# EAGLE design nes-cartridge (EAGLE 9.6.2)
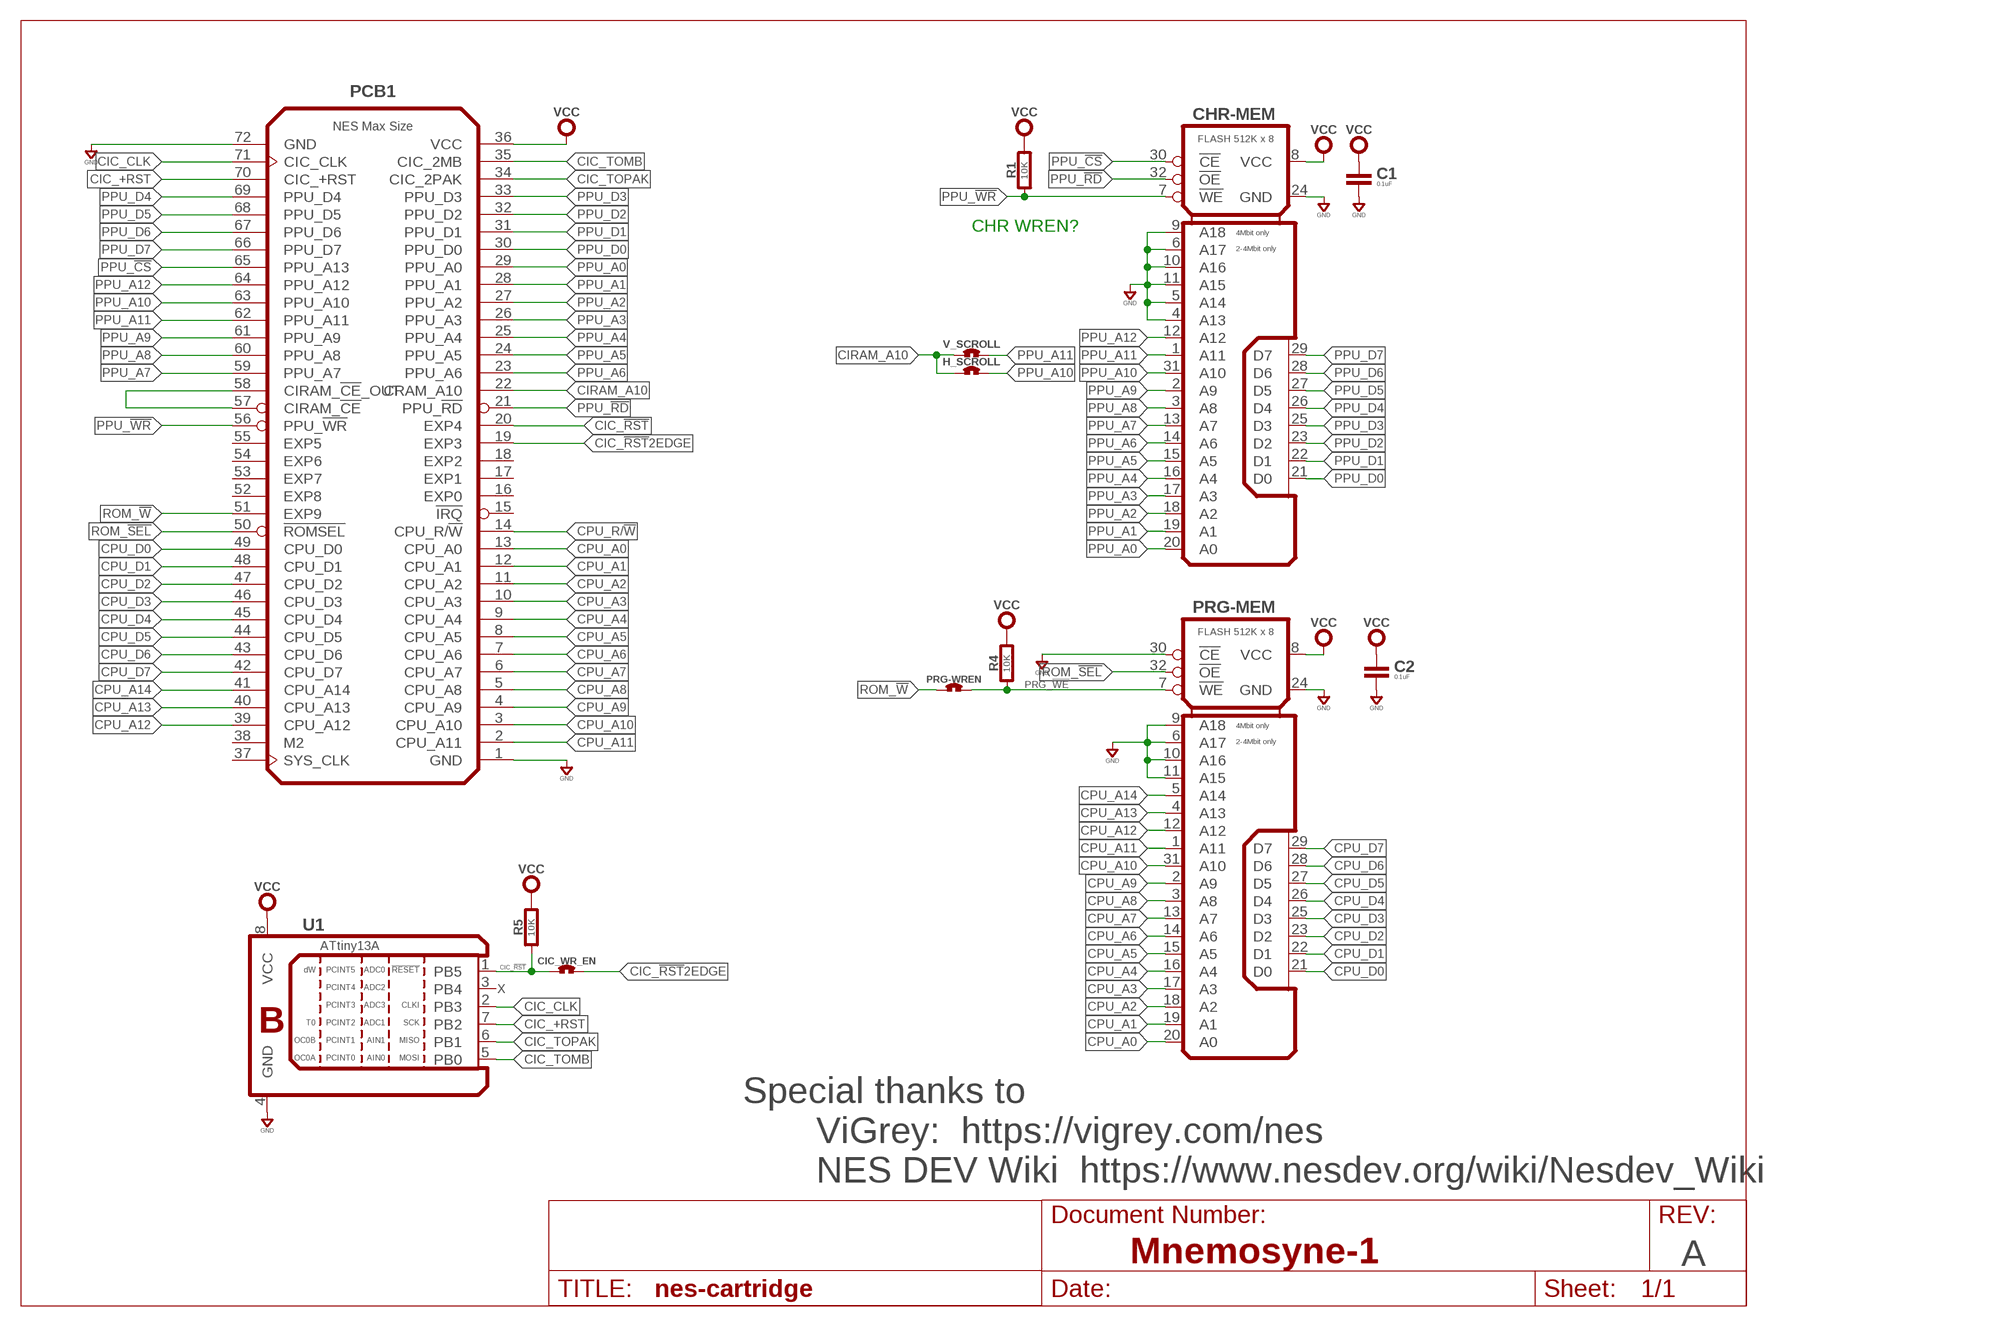
[diagram p0: schematic, sheet 1]
FRAME1 (LETTER_L): DOCUMENT_NUMBER: Mnemosyne-1; REV: A

## Parts
C1  0.1uF  CAPACITOR0603  [0603-CAP]
C2  0.1uF  CAPACITOR0603  [0603-CAP]
CHR-MEM  FLASH 512K x 8  FLASH_512KX8-512K-TSOP  [TSOP32-14X8MM]
CIC_WR_EN  SOLDER_JUMPER-80MIL-RND  [SOLDER_JUMP_80MIL_RND]
H_SCROLL  SOLDER_JUMPER-80MIL-RND  [SOLDER_JUMP_80MIL_RND]
PCB1  NES Max Size  NES-CARTRIDGE-MAX  [NES-1-MIN]
PRG-MEM  FLASH 512K x 8  FLASH_512KX8-512K-TSOP  [TSOP32-14X8MM]
PRG-WREN  SOLDER_JUMPER-80MIL-RND  [SOLDER_JUMP_80MIL_RND]
R1  10K  RESISTOR0603  [0603-RES]
R4  10K  RESISTOR0603  [0603-RES]
R5  10K  RESISTOR0603  [0603-RES]
U1  ATtiny13A  ATTINY13A-SO8  [SOIC-8S2]
V_SCROLL  SOLDER_JUMPER-80MIL-RND  [SOLDER_JUMP_80MIL_RND]

## Nets
CIC_!RST: CIC_WR_EN.1 PCB1.20(EXP4) R5.1 U1.1(PB5)
CIC_!RST!2EDGE: CIC_WR_EN.2 PCB1.19(EXP3)
CIC_+RST: PCB1.70(CIC_+RST) U1.7(PB2)
CIC_CLK: PCB1.71(CIC_CLK) U1.2(PB3)
CIC_TOMB: PCB1.35(CIC_2MB) U1.5(PB0)
CIC_TOPAK: PCB1.34(CIC_2PAK) U1.6(PB1)
CIRAM_A10: H_SCROLL.1 PCB1.22(CRAM_A10) V_SCROLL.1
CPU_A0: PCB1.13(CPU_A0) PRG-MEM.20(A0)
CPU_A1: PCB1.12(CPU_A1) PRG-MEM.19(A1)
CPU_A2: PCB1.11(CPU_A2) PRG-MEM.18(A2)
CPU_A3: PCB1.10(CPU_A3) PRG-MEM.17(A3)
CPU_A4: PCB1.9(CPU_A4) PRG-MEM.16(A4)
CPU_A5: PCB1.8(CPU_A5) PRG-MEM.15(A5)
CPU_A6: PCB1.7(CPU_A6) PRG-MEM.14(A6)
CPU_A7: PCB1.6(CPU_A7) PRG-MEM.13(A7)
CPU_A8: PCB1.5(CPU_A8) PRG-MEM.3(A8)
CPU_A9: PCB1.4(CPU_A9) PRG-MEM.2(A9)
CPU_A10: PCB1.3(CPU_A10) PRG-MEM.31(A10)
CPU_A11: PCB1.2(CPU_A11) PRG-MEM.1(A11)
CPU_A12: PCB1.39(CPU_A12) PRG-MEM.12(A12)
CPU_A13: PCB1.40(CPU_A13) PRG-MEM.4(A13)
CPU_A14: PCB1.41(CPU_A14) PRG-MEM.5(A14)
CPU_D0: PCB1.49(CPU_D0) PRG-MEM.21(D0)
CPU_D1: PCB1.48(CPU_D1) PRG-MEM.22(D1)
CPU_D2: PCB1.47(CPU_D2) PRG-MEM.23(D2)
CPU_D3: PCB1.46(CPU_D3) PRG-MEM.25(D3)
CPU_D4: PCB1.45(CPU_D4) PRG-MEM.26(D4)
CPU_D5: PCB1.44(CPU_D5) PRG-MEM.27(D5)
CPU_D6: PCB1.43(CPU_D6) PRG-MEM.28(D6)
CPU_D7: PCB1.42(CPU_D7) PRG-MEM.29(D7)
CPU_R/!W: PCB1.14(CPU_R/!W)
GND: C1.2 C2.2 CHR-MEM.4(A13) CHR-MEM.5(A14) CHR-MEM.6(A17) CHR-MEM.9(A18) CHR-MEM.10(A16) CHR-MEM.11(A15) CHR-MEM.24(GND) PCB1.1(GND) PCB1.72(GND) PRG-MEM.6(A17) PRG-MEM.9(A18) PRG-MEM.10(A16) PRG-MEM.11(A15) PRG-MEM.24(GND) U1.4(GND)
N$1: PRG-MEM.30(!CE) ; supply symbol labelled GND
N$29: PCB1.57(CIRAM_!CE) PCB1.58(CIRAM_!CE!_OUT)
PPU_!CS: CHR-MEM.30(!CE) PCB1.65(PPU_A13)
PPU_!RD: CHR-MEM.32(!OE) PCB1.21(PPU_!RD)
PPU_!WR: CHR-MEM.7(!WE) PCB1.56(PPU_!WR) R1.1
PPU_A0: CHR-MEM.20(A0) PCB1.29(PPU_A0)
PPU_A1: CHR-MEM.19(A1) PCB1.28(PPU_A1)
PPU_A2: CHR-MEM.18(A2) PCB1.27(PPU_A2)
PPU_A3: CHR-MEM.17(A3) PCB1.26(PPU_A3)
PPU_A4: CHR-MEM.16(A4) PCB1.25(PPU_A4)
PPU_A5: CHR-MEM.15(A5) PCB1.24(PPU_A5)
PPU_A6: CHR-MEM.14(A6) PCB1.23(PPU_A6)
PPU_A7: CHR-MEM.13(A7) PCB1.59(PPU_A7)
PPU_A8: CHR-MEM.3(A8) PCB1.60(PPU_A8)
PPU_A9: CHR-MEM.2(A9) PCB1.61(PPU_A9)
PPU_A10: CHR-MEM.31(A10) H_SCROLL.2 PCB1.63(PPU_A10)
PPU_A11: CHR-MEM.1(A11) PCB1.62(PPU_A11) V_SCROLL.2
PPU_A12: CHR-MEM.12(A12) PCB1.64(PPU_A12)
PPU_D0: CHR-MEM.21(D0) PCB1.30(PPU_D0)
PPU_D1: CHR-MEM.22(D1) PCB1.31(PPU_D1)
PPU_D2: CHR-MEM.23(D2) PCB1.32(PPU_D2)
PPU_D3: CHR-MEM.25(D3) PCB1.33(PPU_D3)
PPU_D4: CHR-MEM.26(D4) PCB1.69(PPU_D4)
PPU_D5: CHR-MEM.27(D5) PCB1.68(PPU_D5)
PPU_D6: CHR-MEM.28(D6) PCB1.67(PPU_D6)
PPU_D7: CHR-MEM.29(D7) PCB1.66(PPU_D7)
PRG_!WE: PRG-MEM.7(!WE) PRG-WREN.2 R4.1
ROM_!SEL: PCB1.50(!ROMSEL) PRG-MEM.32(!OE)
ROM_!W: PCB1.51(EXP9) PRG-WREN.1
VCC: C1.1 C2.1 CHR-MEM.8(VCC) PCB1.36(VCC) PRG-MEM.8(VCC) R1.2 R4.2 R5.2 U1.8(VCC)
Unconnected: PCB1.15(!IRQ) PCB1.16(EXP0) PCB1.17(EXP1) PCB1.18(EXP2) PCB1.37(SYS_CLK) PCB1.38(M2) PCB1.52(EXP8) PCB1.53(EXP7) PCB1.54(EXP6) PCB1.55(EXP5) U1.3(PB4)

## Notes on the sheet
- CHR WREN?
- X
- Special thanks to 
         ViGrey:  https://vigrey.com/nes
         NES DEV Wiki  https://www.nesdev.org/wiki/Nesdev_Wiki

## Library data of the parts
C1 C2 = rlc:CAPACITOR: Capacitor; COST01: 0.12; COST10: 0.09; COST100: 0.05
CHR-MEM PRG-MEM = logic:FLASH_512KX8: Flash - 8 bit parallel, up to 512Kx8; COST01: 2.30; COST10: 2.10; COST100: 1.80; MFR: Microchip; MPN: SST39SF040-70-4C-Wxx
CIC_WR_EN H_SCROLL PRG-WREN V_SCROLL = rlc:SOLDER_JUMPER
PCB1 = game-cartridge:NES-CARTRIDGE: NES Cartridge
R1 R4 R5 = rlc:RESISTOR: Resistor; COST01: 0.10; COST10: 0.05; COST100: 0.02
U1 = atmel-atmega:ATTINY13A: ATmega 13A microcontroller; COST01: 1.10; COST10: 1.00; COST100: 0.80; MFR: Microchip; MPN: ATTINY13A-S

## Board
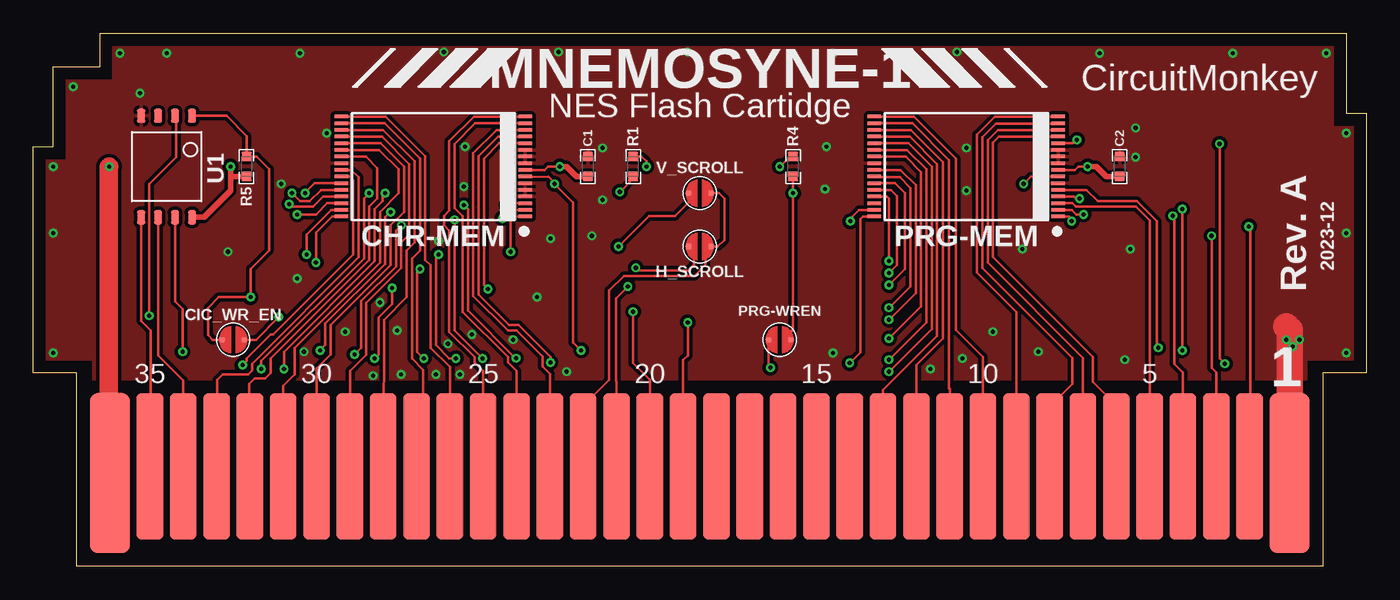
[diagram p1: board, top side]
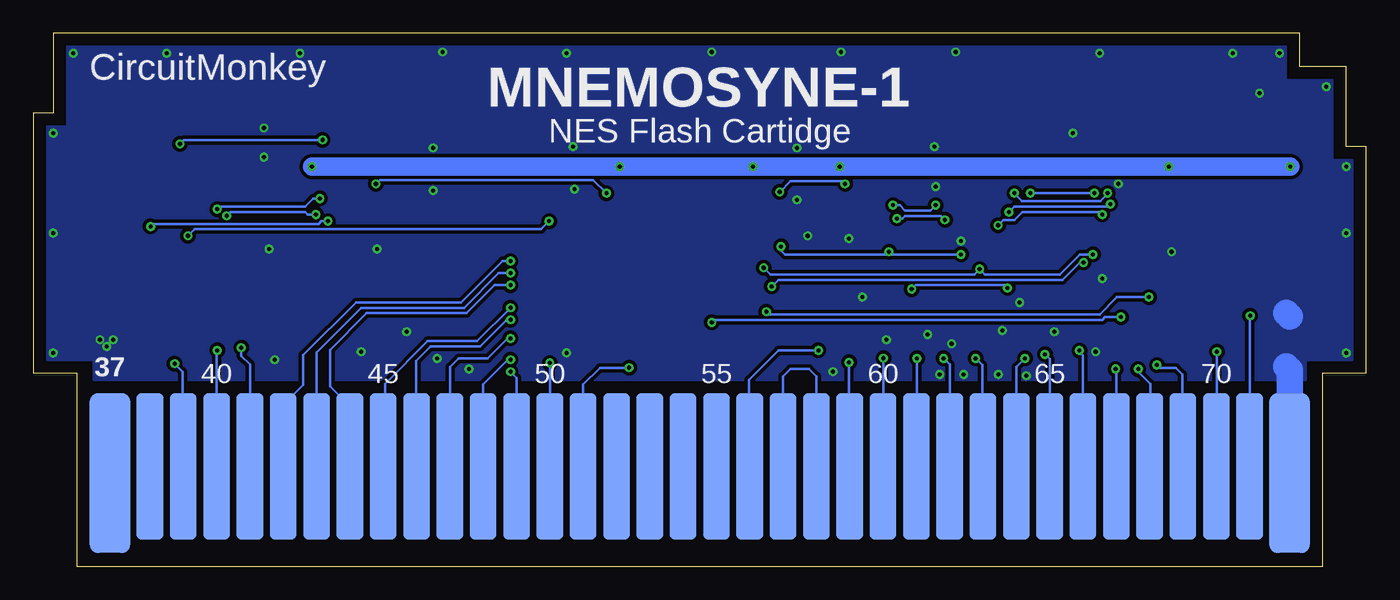
[diagram p2: board, bottom side, seen from below]

Size 100 x 40 mm. Coordinates in mm from the lower left corner, seen from the top.
Copper layers (1*16): Top 0.0356mm / dielectric 1.5011mm / Bottom 0.0356mm
Design rules "OSH-CircuitMonkey": minimum track width 6mil, minimum drill 12mil, track to track 6mil, track to pad 6mil, pad to pad 6mil, via to via 6mil, smd to smd 6mil, copper to edge 15mil, drill to drill 6mil, minimum pad ring 7mil, minimum via ring 7mil, stop-mask expansion 3mil, vias tented up to drill 13mil, thermal gap 10mil

### Footprints (pad centres in the part's own frame; a part is rotated, then mirrored left to right if it is on the bottom)
0603-CAP = smd 0.711 x 0.762: 1 -0.752,0; 2 0.752,0
TSOP32-14X8MM = smd 0.27 x 1.1: 1 -3.75,-6.9; 2 -3.25,-6.9; 3 -2.75,-6.9; 4 -2.25,-6.9; 5 -1.75,-6.9; 6 -1.25,-6.9; 7 -0.75,-6.9; 8 -0.25,-6.9; 9 0.25,-6.9; 10 0.75,-6.9; 11 1.25,-6.9; 12 1.75,-6.9; 13 2.25,-6.9; 14 2.75,-6.9; 15 3.25,-6.9; 16 3.75,-6.9; 17 3.75,6.9; 18 3.25,6.9; 19 2.75,6.9; 20 2.25,6.9; 21 1.75,6.9; 22 1.25,6.9; 23 0.75,6.9; 24 0.25,6.9; 25 -0.25,6.9; 26 -0.75,6.9; 27 -1.25,6.9; 28 -1.75,6.9; 29 -2.25,6.9; 30 -2.75,6.9; 31 -3.25,6.9; 32 -3.75,6.9
SOLDER_JUMP_80MIL_RND = smd 0.406 x 0.406: 1 -0.838,0; 2 0.838,0
NES-1-MIN = smd 3 x 12: 1 94.25,7; 36 5.75,7 | smd 2 x 11: 2 91.25,7.5; 3 88.75,7.5; 4 86.25,7.5; 5 83.75,7.5; 6 81.25,7.5; 7 78.75,7.5; 8 76.25,7.5; 9 73.75,7.5; 10 71.25,7.5; 11 68.75,7.5; 12 66.25,7.5; 13 63.75,7.5; 14 61.25,7.5; 15 58.75,7.5; 16 56.25,7.5; 17 53.75,7.5; 18 51.25,7.5; 19 48.75,7.5; 20 46.25,7.5; 21 43.75,7.5; 22 41.25,7.5; 23 38.75,7.5; 24 36.25,7.5; 25 33.75,7.5; 26 31.25,7.5; 27 28.75,7.5; 28 26.25,7.5; 29 23.75,7.5; 30 21.25,7.5; 31 18.75,7.5; 32 16.25,7.5; 33 13.75,7.5; 34 11.25,7.5; 35 8.75,7.5 | smd 3 x 12 bottom: 37 94.25,7; 72 5.75,7 | smd 2 x 11 bottom: 38 91.25,7.5; 39 88.75,7.5; 40 86.25,7.5; 41 83.75,7.5; 42 81.25,7.5; 43 78.75,7.5; 44 76.25,7.5; 45 73.75,7.5; 46 71.25,7.5; 47 68.75,7.5; 48 66.25,7.5; 49 63.75,7.5; 50 61.25,7.5; 51 58.75,7.5; 52 56.25,7.5; 53 53.75,7.5; 54 51.25,7.5; 55 48.75,7.5; 56 46.25,7.5; 57 43.75,7.5; 58 41.25,7.5; 59 38.75,7.5; 60 36.25,7.5; 61 33.75,7.5; 62 31.25,7.5; 63 28.75,7.5; 64 26.25,7.5; 65 23.75,7.5; 66 21.25,7.5; 67 18.75,7.5; 68 16.25,7.5; 69 13.75,7.5; 70 11.25,7.5; 71 8.75,7.5
0603-RES = smd 0.711 x 0.762: 1 -0.752,0; 2 0.752,0
SOIC-8S2 = smd 0.61 x 1.067: 1 -1.905,-3.81; 2 -0.635,-3.81; 3 0.635,-3.81; 4 1.905,-3.81; 5 1.905,3.81; 6 0.635,3.81; 7 -0.635,3.81; 8 -1.905,3.81

### Placement (x,y rotation side)
C1  41.6,30 90 top
C2  81.5,30 90 top
CHR-MEM  30,30 90 top
CIC_WR_EN  15,17 0 top
H_SCROLL  50,24 180 top
PCB1  0,0 0 top
PRG-MEM  70,30 90 top
PRG-WREN  56,17 0 top
R1  45,30 90 top
R4  57,30 90 top
R5  16,30 270 top
U1  10,30 180 top
V_SCROLL  50,28 180 top

### Tracks (layer width: path | path; a pad name or v marks a point on that pad's centre or on a via)
CIC_!RST  (via drill 0.3)
  Top 0.2: CIC_WR_EN.1 13.46,17 13.1,17.36 13.1,19.4 13.9,20.2 v16.3,20.2 16.3,22.3 17.7,23.7 17.7,29.8 16.75,30.75 R5.1 16,32.3 14.49,33.81 U1.1 | v45,19.1 45,15.25 46.25,14 PCB1.20
  Bottom 0.2: v16.3,20.2 18.7,20.2 20,18.9 44.8,18.9 v45,19.1
CIC_!RST!2EDGE  (via drill 0.3)
  Top 0.2: CIC_WR_EN.2 16.7,17 v18.4,18.7 | v49.1,18.3 49.1,15.82 48.75,15.47 PCB1.19
  Bottom 0.2: v18.4,18.7 19.6,18.7 19.8,18.5 48.9,18.5 v49.1,18.3
CIC_+RST  (via drill 0.3)
  Top 0.2: U1.7 10.63,19.86 11.2,19.3 v11.2,16.1
  Bottom 0.2: v11.2,16.1 11.2,7.55 PCB1.70
CIC_CLK  (via drill 0.3)
  Top 0.2: U1.2 10.7,33.74 10.7,30.7 8.7,28.7 v8.7,18.8
  Bottom 0.2: PCB1.71 8.75,18.75 v8.7,18.8
CIC_TOMB
  Top 0.2: U1.5 8.1,18.41 8.8,17.7 8.8,7.55 PCB1.35
CIC_TOPAK
  Top 0.2: U1.6 9.37,15.84 11.25,13.95 PCB1.34
CIRAM_A10
  Top 0.2: PCB1.22 41.25,12.05 43.2,14 43.2,20.7 44.3,21.8 49.6,21.8 50.44,22.64 50.44,23.6 H_SCROLL.1 51.34,24 51.84,24.5 51.84,27.6 51.44,28 V_SCROLL.1
CPU_A0
  Top 0.2: PRG-MEM.20 65.75,32.25 67.8,30.2 67.8,17.3 63.75,13.25 PCB1.13
CPU_A1
  Top 0.2: PRG-MEM.19 65.85,32.75 68.25,30.35 68.25,17.1 66.25,15.1 PCB1.12
CPU_A2
  Top 0.2: PCB1.11 68.75,13.3 68.7,13.35 68.7,30.5 65.95,33.25 PRG-MEM.18
CPU_A3
  Top 0.2: PCB1.10 71.25,15.7 69.2,17.75 69.2,30.6 66.05,33.75 PRG-MEM.17
CPU_A4
  Top 0.2: PCB1.9 73.75,19.1 70.8,22.05 70.8,32.4 72.15,33.75 PRG-MEM.16
CPU_A5
  Top 0.2: PRG-MEM.15 76.85,33.2 72.2,33.2 71.2,32.2 71.2,22.4 77.95,15.65 77.95,13.7 76.25,12 PCB1.8
CPU_A6
  Top 0.2: PRG-MEM.14 72.35,32.75 71.6,32 71.6,22.8 78.75,15.65 PCB1.7
CPU_A7
  Top 0.2: PCB1.6 81.25,12.1 79.5,13.85 79.5,15.7 72,23.2 72,31.8 72.45,32.25 PRG-MEM.13
CPU_A8
  Top 0.2: PCB1.5 83.75,25.95 82.7,27 78.2,27 77.95,27.25 PRG-MEM.3
CPU_A9  (via drill 0.3)
  Top 0.2: PCB1.4 86.25,14.55 85.6,15.2 85.6,26.2 v85.5,26.3 | PRG-MEM.2 77.9,26.75 78.25,26.4 v78.8,26.4
  Bottom 0.2: v85.5,26.3 85.2,26.6 79.6,26.6 79.4,26.4 v78.8,26.4
CPU_A10  (via drill 0.3)
  Top 0.2: PCB1.3 88.75,14.53 88.4,14.88 v88.4,24.8 | PRG-MEM.31 61.95,26.75 61.3,26.1 v61.3,25.9
  Bottom 0.2: v61.3,25.9 61.9,25.3 87.9,25.3 v88.4,24.8
CPU_A11  (via drill 0.3)
  Top 0.2: PCB1.2 91.3,7.55 91.3,25.4 v91.2,25.5 | v77.9,25.9 77.9,26.05 77.7,26.25 PRG-MEM.1
  Bottom 0.2: v77.9,25.9 78.4,25.9 78.6,25.7 91,25.7 v91.2,25.5
CPU_A12  (via drill 0.3)
  Top 0.2: v89,31.7 89,15.6 v89.4,15.2 | PRG-MEM.12 78,31.75 78.25,32 v78.3,32
  Bottom 0.2: PCB1.39 88.8,7.55 88.8,14.6 v89.4,15.2 | v89,31.7 88.7,32 v78.3,32
CPU_A13  (via drill 0.3)
  Top 0.2: PRG-MEM.4 78.05,27.75 78.2,27.6 v78.5,27.6 | v86.2,26.8 v86.2,16.2
  Bottom 0.2: v78.5,27.6 79,27.6 79.6,27 86,27 v86.2,26.8 | v86.2,16.2 86.25,16.15 PCB1.40
CPU_A14  (via drill 0.3)
  Top 0.2: PRG-MEM.5 79.02,28.25 79.87,27.4 82.8,27.4 84.3,25.9 84.3,16.7 84.4,16.6 v84.4,16.4
  Bottom 0.2: PCB1.41 83.75,15.15 84.4,15.8 v84.4,16.4
CPU_D0  (via drill 0.3)
  Top 0.2: PRG-MEM.21 65.65,31.75 67.4,30 67.4,17.8 v64.2,14.6
  Bottom 0.2: v64.2,14.6 63.75,14.15 PCB1.49
CPU_D1  (via drill 0.3)
  Top 0.2: PRG-MEM.22 65.55,31.25 67,29.8 67,18.3 v64.2,15.5
  Bottom 0.2: PCB1.48 66.25,13.65 64.4,15.5 v64.2,15.5
CPU_D2  (via drill 0.3)
  Top 0.2: PRG-MEM.23 65.45,30.75 66.6,29.6 66.6,19.5 v64.2,17.1
  Bottom 0.2: v64.2,17.1 64.4,17.1 65.9,15.6 68.1,15.6 68.75,14.95 PCB1.47
CPU_D3  (via drill 0.3)
  Top 0.2: PRG-MEM.25 65.05,29.75 66.2,28.6 66.2,20.5 v64.2,18.5
  Bottom 0.2: PCB1.46 71.3,7.55 71.3,15.4 70.2,16.5 66.5,16.5 64.5,18.5 v64.2,18.5
CPU_D4  (via drill 0.3)
  Top 0.2: PRG-MEM.26 63.15,29.2 65,29.2 65.8,28.4 65.8,21 v64.2,19.4
  Bottom 0.2: PCB1.45 73.6,7.65 73.6,13.7 70.4,16.9 66.7,16.9 v64.2,19.4
CPU_D5  (via drill 0.3)
  Top 0.2: PRG-MEM.27 64.65,28.75 65.4,28 65.4,22.3 v64.2,21.1
  Bottom 0.2: v64.2,21.1 65.4,21.1 67.5,19 75,19 77.75,16.25 77.75,13.5 76.25,12 PCB1.44
CPU_D6  (via drill 0.3)
  Top 0.2: PRG-MEM.28 64.35,28.25 64.8,27.8 64.8,22.6 v64.2,22
  Bottom 0.2: PCB1.43 78.75,16.05 75.4,19.4 67.7,19.4 65.1,22 v64.2,22
CPU_D7  (via drill 0.3)
  Top 0.2: PRG-MEM.29 64.05,27.75 64.2,27.6 v64.2,22.9
  Bottom 0.2: PCB1.42 81.25,12.1 79.75,13.6 79.75,15.85 75.8,19.8 67.9,19.8 64.8,22.9 v64.2,22.9
GND  (via drill 0.3)
  Top 1.27: 94.25,16.75 v94,17
  Top 2: 94.25,16.75 PCB1.1 94.25,17.75 94,18
  Bottom 2: 5.75,18.75 6,19 | PCB1.72 5.75,14.75 6,15
  other vias: 1.5,16 1.5,30 3,36 6.5,38.5 97,38.5 98.5,32.5 98.5,16 95,17 94.5,16.5 8,35.5 22,32.5 42.7,27.5 49.1,38.6 60,38.5 39.4,38.6 69.3,38.6 80,38.5 90,38.5 30.8,38.6 20,38.5 10,38.5 1.5,25 98.5,25 60,16 40,14.6 30.2,14.4 74.2,23.8 82.3,23.8 81.9,15.5 30.4,24.4 32.3,28.5 32.4,31.5 42.7,31.4 82.7,30.7 82.7,32.9 70,31.4 70,28.2 59.5,31.5 59.4,28.3 18.6,28.7 20.3,16.1 23.4,17.6 27.3,17.7 32.9,17.4 31.1,16.7 36,17 32,14.4 27.6,14.4 25.5,14.3 26,19.8 67.3,14.8 75.4,16.1 72,17.6 69.7,15.6 37.8,20.2 19.8,21.6 41.9,24.8 38.8,24.6 14.6,23.6
  pour Top (isolate 0.254, rank 5): 4.5,15.5 1,15.5 1,30.5 2.5,30.5 2.5,36.5 6,36.5 6,39 97.5,39 97.5,33 99,33 99,15.5 95.5,15.5 95.5,14 4.5,14
  pour Bottom (isolate 0.254, rank 5): 4.5,15.5 1,15.5 1,30.5 2.5,30.5 2.5,36.5 6,36.5 6,39 97.5,39 97.5,33 99,33 99,15.5 95.5,15.5 95.5,14 4.5,14
N$29
  Bottom 0.2: PCB1.58 41.25,14.25 41.8,14.8 43.2,14.8 43.75,14.25 PCB1.57
PPU_!CS  (via drill 0.3)
  Top 0.2: CHR-MEM.30 22.05,27.25 21.2,26.4 v19.8,26.4 | v27.61,25.59 27.22,25.2 27.2,25.2 27.2,22.5 24.6,19.9 24.6,16.4 v24.1,15.9
  Bottom 0.2: PCB1.65 23.75,15.55 v24.1,15.9 | v19.8,26.4 20,26.6 25.8,26.6 26.41,25.99 27.21,25.99 v27.61,25.59
PPU_!RD  (via drill 0.3)
  Top 0.2: PCB1.21 43.75,13.85 43.7,13.9 43.7,20.1 v44.6,21 | CHR-MEM.32 22.4,26.25 21.2,25.05 v21.2,22.8
  Bottom 0.2: v21.2,22.8 21.5,22.8 22.8,21.5 44.1,21.5 v44.6,21
PPU_!WR  (via drill 0.3)
  Top 0.152: CHR-MEM.7 38.65,29.25 39.15,28.75 v39.1,28.7
  Top 0.2: v39.1,28.7 40.5,27.3 40.5,16.8 v41.1,16.2 | R1.1 45,29.1 v44,28.1
  Bottom 0.2: v41.1,16.2 44.1,16.2 46.3,14 46.3,7.55 PCB1.56 | v39.1,28.7 39.3,28.9 43.2,28.9 v44,28.1
PPU_A0
  Top 0.2: PCB1.29 23.75,14.65 24.95,15.85 24.95,19.75 27.6,22.4 27.6,24.3 28.2,24.9 28.2,30.2 26.15,32.25 CHR-MEM.20
PPU_A1
  Top 0.2: CHR-MEM.19 26.25,32.75 28.6,30.4 28.6,24.3 28,23.7 28,20.2 26.3,18.5 26.3,15.9 PCB1.28
PPU_A2
  Top 0.2: CHR-MEM.18 26.35,33.25 29,30.6 29,23.7 28.4,23.1 28.4,15.6 29.25,14.75 29.25,8 PCB1.27
PPU_A3
  Top 0.2: CHR-MEM.17 26.45,33.75 29.4,30.8 29.4,23 29.8,22.6 29.8,16.39 31.25,14.95 PCB1.26
PPU_A4
  Top 0.2: PCB1.25 33.75,14.65 33.1,15.3 33.1,15.7 31.2,17.6 31.2,25.2 30.8,25.6 30.8,26.3 31.2,26.7 31.2,31.9 33.05,33.75 CHR-MEM.16
PPU_A5
  Top 0.2: PCB1.24 36.25,14.65 35.6,15.3 35.6,15.7 32.2,19.1 32.2,26.3 31.6,26.9 31.6,31.7 33.15,33.25 CHR-MEM.15
PPU_A6
  Top 0.2: CHR-MEM.14 34.75,32.75 33,31 33,20.3 35.6,17.7 36.25,17.7 38.2,15.75 38.2,15 38.75,14.45 PCB1.23
PPU_A7  (via drill 0.3)
  Top 0.2: CHR-MEM.13 34.85,32.25 33.4,30.8 33.4,20.4 35.7,18.1 36.4,18.1 38.8,15.7 v38.8,15.3
  Bottom 0.2: v38.8,15.3 38.8,8.3 38.9,8.2 38.9,7.65 PCB1.59
PPU_A8  (via drill 0.3)
  Top 0.2: v35.5,27.1 35.65,27.25 CHR-MEM.3 | v32.3,27.1 32.6,26.8 32.6,19.2 36.19,15.61 v36.21,15.61
  Bottom 0.2: v36.21,15.61 36.21,8.79 36.3,8.7 36.3,7.55 PCB1.60 | v35.5,27.1 35,27.1 34.6,26.7 32.7,26.7 v32.3,27.1
PPU_A9  (via drill 0.3)
  Top 0.2: v33.7,15.6 31.6,17.7 v31.6,26 | CHR-MEM.2 36.05,26.75 35.4,26.1 v35.2,26.1
  Bottom 0.2: v33.7,15.6 33.7,6.5 33.75,6.55 PCB1.61 | v35.2,26.1 34.8,26.1 34.6,26.3 31.9,26.3 v31.6,26
PPU_A10  (via drill 0.3)
  Top 0.2: H_SCROLL.2 49.56,23.6 49.56,22.66 49.1,22.2 45.4,22.2 v45.2,22.4 | CHR-MEM.31 22.35,26.75 20.5,24.9 v20.5,23.4 | v29.3,15.6 28.8,16.1 28.8,22.1 v29,22.3
  Bottom 0.2: v45.2,22.4 44.7,21.9 29.4,21.9 v29,22.3 28.6,21.9 23,21.9 21.5,23.4 v20.5,23.4 | PCB1.63 28.8,7.55 28.8,15.1 v29.3,15.6
PPU_A11  (via drill 0.3)
  Top 0.2: V_SCROLL.2 49.16,27.3 48.16,26.3 46.2,26.3 v43.9,24 | v31.7,15.6 31.2,15.6 30.2,16.6 30.2,23.2 v30.4,23.4 | v35.8,23.6 35.8,25.95 36.1,26.25 CHR-MEM.1
  Bottom 0.2: v31.7,15.6 31.25,15.15 PCB1.62 | v30.4,23.4 35.6,23.4 v35.8,23.6 36,23.4 43.6,23.4 43.9,23.7 v43.9,24
PPU_A12  (via drill 0.3)
  Top 0.2: CHR-MEM.12 34.95,31.75 33.8,30.6 33.8,21.1 v34.1,20.8 | v26.91,20.89 26.91,19.69 25.9,18.68 25.9,15.9 v25.6,15.6
  Bottom 0.2: v34.1,20.8 33.8,21.1 27.12,21.1 v26.91,20.89 | v25.6,15.6 26.25,14.95 PCB1.64
PPU_D0
  Top 0.2: CHR-MEM.21 26.05,31.75 27.8,30 27.8,26.6 26.8,25.6 26.8,22.6 22.3,18.1 22.3,15.9 21.25,14.85 PCB1.30
PPU_D1
  Top 0.2: PCB1.31 18.75,13.55 19.6,14.4 19.6,16.4 26,22.8 26,26.6 27.4,28 27.4,29.8 25.95,31.25 CHR-MEM.22
PPU_D2
  Top 0.2: PCB1.32 16.25,12.85 16.2,12.9 16.2,13.7 16.6,14.1 17.4,14.1 17.8,14.5 17.8,15.6 25.2,23 25.2,27 25.8,27.6 25.8,29.9 24.95,30.75 CHR-MEM.23
PPU_D3
  Top 0.2: PCB1.33 13.8,7.55 13.8,14 14.2,14.4 16.1,14.4 16.4,14.7 16.4,15.2 24.4,23.2 24.4,29.2 23.85,29.75 CHR-MEM.25
PPU_D4  (via drill 0.3)
  Top 0.2: CHR-MEM.26 23.75,29.25 24,29 24,23.4 18,17.4 17.8,17.4 16,15.6 16,15.4 v15.7,15.1
  Bottom 0.2: PCB1.69 13.75,6.15 13.8,6.1 13.8,14.4 14.3,14.9 15.5,14.9 v15.7,15.1
PPU_D5  (via drill 0.3)
  Top 0.2: CHR-MEM.27 21.1,28.75 20.4,28.05 v20.4,28 | v25.2,28 24.8,27.6 24.8,23.1 17.1,15.4 v17.1,14.8
  Bottom 0.2: PCB1.68 16.25,6.65 16.2,6.6 16.2,13.7 17.1,14.6 v17.1,14.8 | v20.4,28 v25.2,28
PPU_D6  (via drill 0.3)
  Top 0.2: CHR-MEM.28 21.58,28.25 20.73,27.4 20,27.4 v19.4,28 | v26.38,28 26.2,27.82 26.2,27.4 25.6,26.8 25.6,22.9 18.8,16.1 v18.8,14.8
  Bottom 0.2: v19.4,28 19.4,27.98 19.96,27.42 25.84,27.42 26.38,27.96 v26.38,28 | v18.8,14.8 18.75,14.75 PCB1.67
PPU_D7  (via drill 0.3)
  Top 0.2: CHR-MEM.29 21.75,27.75 21,27 19.39,27 v19.2,27.19 | v26.81,26.59 26.79,26.59 26.4,26.2 26.4,22.7 21.91,18.21 21.91,16.59 v21.51,16.19
  Bottom 0.2: v19.2,27.19 19.39,27 26.4,27 v26.81,26.59 | v21.51,16.19 21.51,16.09 21.25,15.83 PCB1.66
PRG_!WE  (via drill 0.3)
  Top 0.2: PRG-WREN.2 56.84,17.6 57,17.76 57,23.9 v57,28 R4.1 | PRG-MEM.7 74.85,29.25 v74.3,28.7
  Bottom 0.2: v74.3,28.7 74,29 58,29 v57,28
ROM_!SEL  (via drill 0.3)
  Top 0.2: PRG-MEM.32 62.25,26.25 62.05,26.05 62.05,16.05 v61.25,15.25
  Bottom 0.2: v61.25,15.25 PCB1.50
ROM_!W  (via drill 0.3)
  Top 0.2: PRG-WREN.1 55.16,15.04 v55.3,14.9
  Bottom 0.2: v55.3,14.9 57.5,14.9 58.75,13.65 PCB1.51
VCC  (via drill 0.3)
  Top 0.2: PRG-MEM.8 78.15,29.75 78.4,30 v79.1,30 | R4.2 56.75,30.75 v56,30 | CHR-MEM.8 38.35,29.75 38.6,30 v39.5,30 | R1.2 45.65,30.75 46,30.4 v46,30
  Top 0.4: U1.8 12.8,26.19 14.8,28.18 v14.8,30 14.8,29.25 R5.2 | v79.1,30 79.75,30 80.5,29.25 C2.1 | C1.1 40.75,29.25 40,30 v39.5,30
  Top 1.4: PCB1.36 5.65,7.1 5.65,29.95 v5.7,30
  Bottom 1.4: v5.7,30 v14.8,30 v39.5,30 v46,30 v56,30 v79.1,30

### Text on the board
tPlace: MNEMOSYNE-1 | CircuitMonkey | NES Flash Cartidge | Rev. A | 2023-12
bPlace: MNEMOSYNE-1 | CircuitMonkey | NES Flash Cartidge